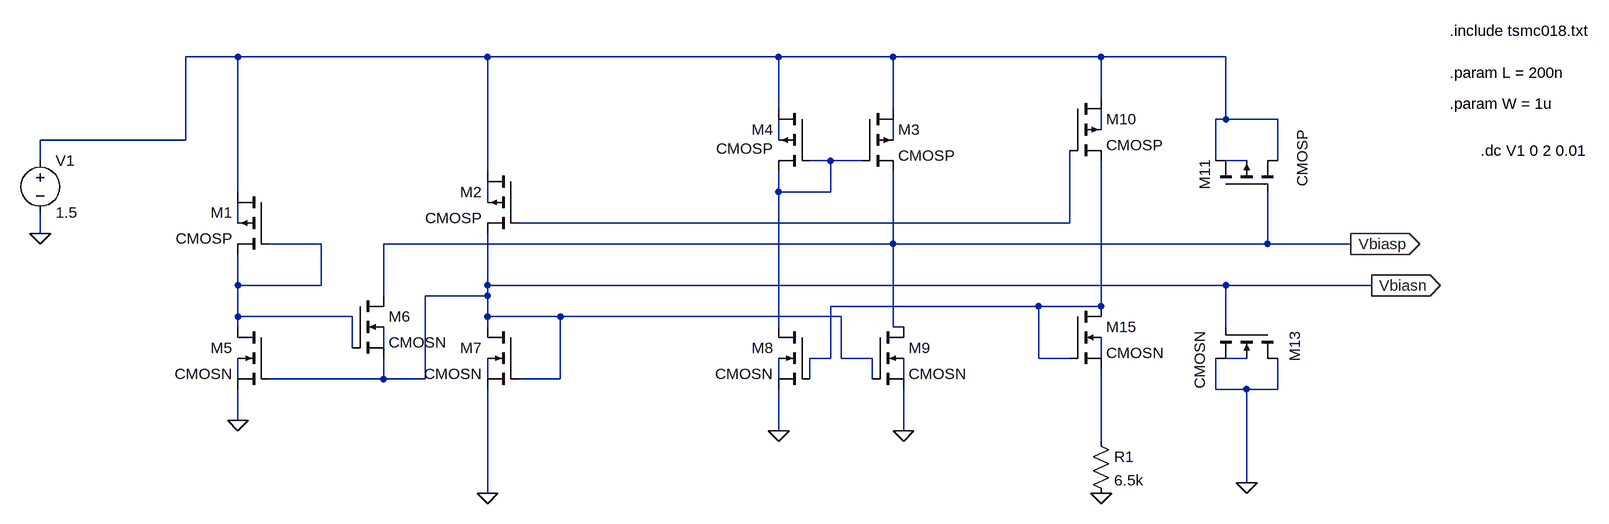
[diagram p0: schematic abcd.asc]
abcd.asc, the LTspice schematic file:
Version 4
SHEET 1 2108 680
WIRE 0 -368 -80 -368
WIRE 384 -368 0 -368
WIRE 832 -368 384 -368
WIRE 1008 -368 832 -368
WIRE 1328 -368 1008 -368
WIRE 1520 -368 1328 -368
WIRE 1328 -304 1328 -368
WIRE 832 -288 832 -368
WIRE 1008 -288 1008 -368
WIRE 1520 -272 1520 -368
WIRE 1520 -272 1504 -272
WIRE 1600 -272 1520 -272
WIRE 1328 -256 1328 -288
WIRE -80 -240 -80 -368
WIRE -80 -240 -304 -240
WIRE 832 -240 832 -272
WIRE 1008 -240 1008 -272
WIRE -304 -208 -304 -240
WIRE 912 -208 880 -208
WIRE 960 -208 912 -208
WIRE 1504 -208 1504 -272
WIRE 1552 -208 1520 -208
WIRE 1600 -208 1600 -272
WIRE 384 -192 384 -368
WIRE 0 -160 0 -368
WIRE 832 -160 832 -192
WIRE 912 -160 912 -208
WIRE 912 -160 832 -160
WIRE 384 -144 384 -176
WIRE 0 -112 0 -144
WIRE 1280 -112 1280 -224
WIRE 1280 -112 432 -112
WIRE -304 -96 -304 -128
WIRE 128 -80 48 -80
WIRE 1008 -80 1008 -192
WIRE 1008 -80 224 -80
WIRE 1584 -80 1584 -160
WIRE 1584 -80 1008 -80
WIRE 1712 -80 1584 -80
WIRE 0 -16 0 -64
WIRE 128 -16 128 -80
WIRE 128 -16 0 -16
WIRE 384 -16 384 -96
WIRE 1520 -16 384 -16
WIRE 1744 -16 1520 -16
WIRE 224 0 224 -80
WIRE 384 0 384 -16
WIRE 384 0 288 0
WIRE 1232 16 912 16
WIRE 1328 16 1328 -208
WIRE 1328 16 1232 16
WIRE 0 32 0 -16
WIRE 176 32 0 32
WIRE 384 32 384 0
WIRE 496 32 384 32
WIRE 928 32 496 32
WIRE 0 48 0 32
WIRE 384 48 384 32
WIRE 832 48 832 -160
WIRE 1008 48 1008 -80
WIRE 1024 48 1008 48
WIRE 1520 48 1520 -16
WIRE 176 80 176 32
WIRE 224 80 224 48
WIRE 912 96 912 16
WIRE 912 96 880 96
WIRE 928 96 928 32
WIRE 976 96 928 96
WIRE 1232 96 1232 16
WIRE 1280 96 1232 96
WIRE 1328 96 1328 64
WIRE 1552 96 1520 96
WIRE 0 128 0 96
WIRE 224 128 224 96
WIRE 224 128 48 128
WIRE 288 128 288 0
WIRE 288 128 224 128
WIRE 384 128 384 96
WIRE 496 128 496 32
WIRE 496 128 432 128
WIRE 832 128 832 96
WIRE 880 128 880 96
WIRE 976 128 976 96
WIRE 1024 128 1024 96
WIRE 1504 144 1504 96
WIRE 1552 144 1504 144
WIRE 1600 144 1600 96
WIRE 1600 144 1552 144
WIRE 0 192 0 144
WIRE 832 208 832 144
WIRE 1024 208 1024 144
WIRE 1328 224 1328 112
WIRE 1552 288 1552 144
WIRE 384 304 384 144
FLAG 0 192 0
FLAG -304 -96 0
FLAG 384 304 0
FLAG 832 208 0
FLAG 1024 208 0
FLAG 1328 304 0
FLAG 1552 288 0
FLAG 1712 -80 Vbiasp
IOPIN 1712 -80 Out
FLAG 1744 -16 Vbiasn
IOPIN 1744 -16 Out
SYMBOL pmos4 48 -160 M0
SYMATTR InstName M1
SYMATTR Value CMOSP
SYMATTR Value2 l=L w=0.1W
SYMBOL pmos4 432 -192 M0
SYMATTR InstName M2
SYMATTR Value CMOSP
SYMATTR Value2 l=L w=10W
SYMBOL pmos4 960 -288 R0
SYMATTR InstName M3
SYMATTR Value CMOSP
SYMATTR Value2 l=L w=10W
SYMBOL pmos4 880 -288 M0
WINDOW 3 56 61 Left 2
SYMATTR Value CMOSP
SYMATTR InstName M4
SYMATTR Value2 l=L w=10W
SYMBOL nmos4 48 48 M0
SYMATTR InstName M5
SYMATTR Value CMOSN
SYMATTR Value2 l=L w=5W
SYMBOL nmos4 176 0 R0
SYMATTR InstName M6
SYMATTR Value CMOSN
SYMATTR Value2 l=L w=2W
SYMBOL nmos4 432 48 M0
SYMATTR InstName M7
SYMATTR Value CMOSN
SYMATTR Value2 l=L w=5W
SYMBOL nmos4 880 48 M0
SYMATTR InstName M8
SYMATTR Value CMOSN
SYMATTR Value2 l=L w=5W
SYMBOL nmos4 976 48 R0
SYMATTR InstName M9
SYMATTR Value CMOSN
SYMATTR Value2 l=L w=5W
SYMBOL voltage -304 -224 R0
WINDOW 123 0 0 Left 0
WINDOW 39 0 0 Left 0
SYMATTR InstName V1
SYMATTR Value 1.5
SYMBOL pmos4 1280 -304 R0
SYMATTR InstName M10
SYMATTR Value CMOSP
SYMATTR Value2 l=L w=10W
SYMBOL pmos4 1504 -160 R270
WINDOW 0 3 -16 Left 2
WINDOW 3 8 134 Left 2
SYMATTR InstName M11
SYMATTR Value CMOSP
SYMATTR Value2 l=L w=W
SYMBOL nmos4 1600 48 R90
WINDOW 0 6 -26 Left 2
WINDOW 3 6 120 Left 2
SYMATTR InstName M13
SYMATTR Value CMOSN
SYMATTR Value2 l=L w=W
SYMBOL nmos4 1280 16 R0
SYMATTR InstName M15
SYMATTR Value CMOSN
SYMATTR Value2 l=2L w=2W
SYMBOL res 1312 208 R0
SYMATTR InstName R1
SYMATTR Value 6.5k
TEXT 1864 -408 Left 2 !.include tsmc018.txt
TEXT 1864 -344 Left 2 !.param L = 200n
TEXT 1864 -296 Left 2 !.param W = 1u
TEXT 1912 -224 Left 2 !.dc V1 0 2 0.01

The netlist it stands for:
* abcd.asc
M1 N001 N010 N010 N008 CMOSP l=L w=0.1W
M2 N001 N009 Vbiasn N007 CMOSP l=L w=10W
M3 N001 N005 Vbiasp N004 CMOSP l=L w=10W
M4 N001 N005 N005 N003 CMOSP l=L w=10W
M5 N010 Vbiasn 0 N015 CMOSN l=L w=5W
M6 Vbiasp N010 Vbiasn N012 CMOSN l=L w=2W
M7 Vbiasn Vbiasn 0 N016 CMOSN l=L w=5W
M8 N005 N011 0 N017 CMOSN l=L w=5W
M9 Vbiasp Vbiasn 0 N018 CMOSN l=L w=5W
V1 N001 0 1.5
M10 N001 N009 N011 N002 CMOSP l=L w=10W
M11 N001 Vbiasp N001 N006 CMOSP l=L w=W
M13 0 Vbiasn 0 N014 CMOSN l=L w=W
M15 N011 N011 N019 N013 CMOSN l=2L w=2W
R1 N019 0 6.5k
.model NMOS NMOS
.model PMOS PMOS
.lib standard.mos
.include tsmc018.txt
.param L = 200n
.param W = 1u
.dc V1 0 2 0.01
.backanno
.end